# Altium schematic sheet v1.0.SchDoc
size 223 x 104 mm; PageSetup: Record=PageOptions|CenterHorizontal=True|CenterVertical=True|PrintScale=0.85|XCorrection=1.00|YCorrection=1.00|PrintKind=0|BorderSize=5000000|LeftOffset=0|BottomOffset=0|Orientation=2|PaperLength=1000|PaperWidth=1000|Scale=100|PaperSource=15|PrintQuality=-3|MediaType=1|DitherType=10|PrintScaleMode=1|PaperKind=A4|PaperIndex=9
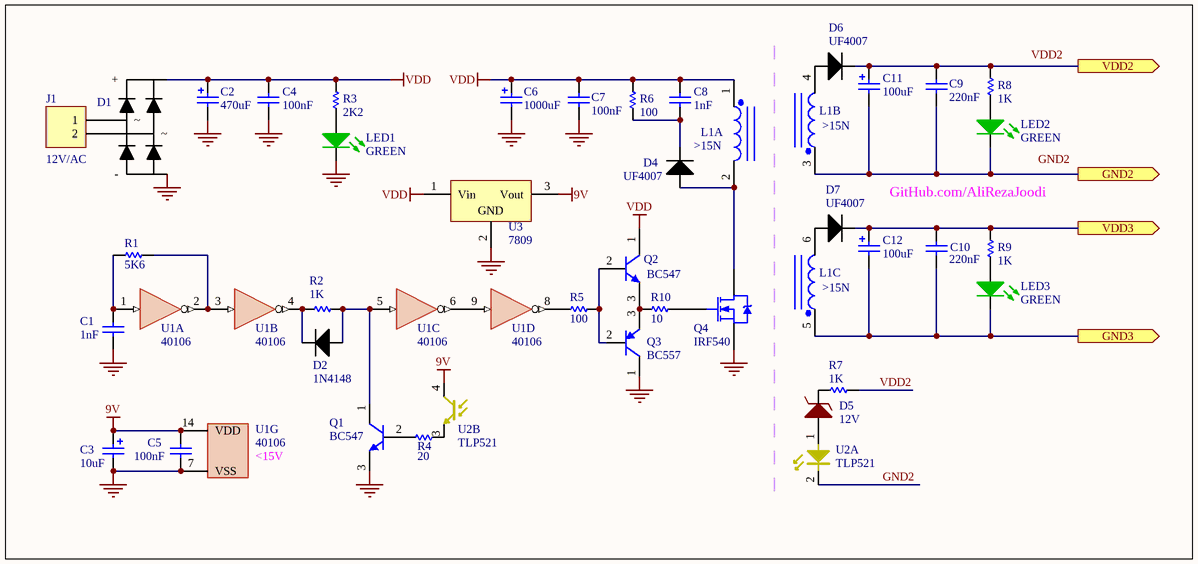
[diagram p0: v1.0.SchDoc]

## Parts
C1  value 1nF  [CAPNTO2.54-3.05x1.78A]  (hidden comment: Cap)
C2  value 470uF  [CAPPR5-10x12.5]  (hidden comment: Cap Pol1)
C3  10uF  [CAPPR5-10x12.5]
C4  value 100nF  [CAPNTO2.54-3.05x1.78A]  (hidden comment: Cap)
C5  100nF  [CAPNTO2.54-3.05x1.78A]
C6  value 1000uF  [CAPPR2.5-6.3x5]  (hidden comment: Cap Pol1)
C7  value 100nF  [CAPNTO2.54-3.05x1.78A]  (hidden comment: Cap)
C8  value 1nF  [CAPNTO2.54-3.56x2.03]  (hidden comment: Cap)
C9  value 220nF  [CAPNTO5.08-7.37x3.94]  (hidden comment: Cap)
C10  value 220nF  [CAPNTO5.08-7.37x3.94]  (hidden comment: Cap)
C11  value 100uF  [CAPPR2.5-6.3x5]  (hidden comment: Cap Pol1)
C12  value 100uF  [CAPPR2.5-6.3x5]  (hidden comment: Cap Pol1)
D1  2A  (value not drawn)
D2  1N4148  [D_THD_AXIAL0.3_DO-35]
D4  UF4007  [D_THD_AXIAL0.3_DO-35]
D5  12V  [D_THD_AXIAL0.3_DO-35]
D6  UF4007  [D_THD_AXIAL0.3_DO-35]
D7  UF4007  [D_THD_AXIAL0.3_DO-35]
J1  Header 2  [Fonics_2PIN_1]  (value not drawn)
L1  >15N  [INDUCTOR3]  (parts A,B,C of 3)
LED1  GREEN  [LED_THD_5MM_GREEN]
LED2  GREEN  [LED_THD_5MM_GREEN]
LED3  GREEN  [LED_THD_5MM_GREEN]
Q1  value BC547  [TO92C]  (hidden comment: NPN)
Q2  Device: BC547  [TO92C]  (hidden comment: NPN)
Q3  BC557  [TO92C]
Q4  IRF540  [TO220V]
R1  5K6  [R_THD_AXIAL0.4(1/4W)]
R2  1K  [R_THD_AXIAL0.4(1/4W)]
R3  2K2  [R_THD_AXIAL0.4(1/4W)]
R4  20  [R_THD_AXIAL0.4(1/4W)]
R5  100  [R_THD_AXIAL0.4(1/4W)]
R6  100  [R_THD_AXIAL0.4(1/4W)]
R7  1K  [R_THD_AXIAL0.4(1/4W)]
R8  1K  [R_THD_AXIAL0.4(1/4W)]
R9  1K  [R_THD_AXIAL0.4(1/4W)]
R10  10  [R_THD_AXIAL0.4(1/4W)]
U1  40106  [DIP_14]  (parts A,B,C,D,G of 7)
U2  TLP521  [DIP_4]  (parts A,B of 2)
U3  7809  [TO220_3PIN_H]

## Ports
GND2 (out), GND3 (out), VDD2 (out), VDD3 (out)

## Nets
9V: C3.1 C5.2 U1.14(VDD) U2.4(C) U3.3(Vout)
GND: C1.1 C2.2 C3.2 C4.1 C5.1 C6.2 C7.1 D1.3(-) LED1.2(K) Q1.3(E) Q3.1(C) Q4.3(S) U1.7(VSS) U3.2(GND)
VDD: C2.1 C4.2 C6.1 C7.2 C8.2 D1.4(+) L1.1 Q2.1(C) R3.2 R6.2 U3.1(Vin)
GND2: C9.1 C11.2 L1.3 LED2.2(K) ; port GND2
GND2: U2.2(K)  [a separate net that carries the same name]
GND3: C10.1 C12.2 L1.5 LED3.2(K) ; port GND3
VDD2: C9.2 C11.1 D6.2(K) R8.2 ; port VDD2
VDD2: R7.1  [a separate net that carries the same name]
VDD3: C10.2 C12.1 D7.2(K) R9.2 ; port VDD3
NetC1_2: C1.2 R1.2 U1.1(I)
NetC8_1: C8.1 D4.2(K) R6.1
NetD1_1: D1.1 J1.2
NetD1_2: D1.2 J1.1
NetD2_1: D2.1(A) Q1.1(C) R2.1 U1.5(I)
NetD2_2: D2.2(K) R2.2 U1.4(~{O})
NetD4_1: D4.1(A) L1.2 Q4.2(D)
NetD5_1: D5.1 U2.1(A)
NetD5_2: D5.2 R7.2
NetD6_1: D6.1(A) L1.4
NetD7_1: D7.1(A) L1.6
NetLED1_1: LED1.1(A) R3.1
NetLED2_1: LED2.1(A) R8.1
NetLED3_1: LED3.1(A) R9.1
NetQ1_2: Q1.2(B) R4.2
NetQ2_2: Q2.2(B) Q3.2(B) R5.1
NetQ2_3: Q2.3(E) Q3.3(E) R10.2
NetQ4_1: Q4.1(G) R10.1
NetR1_1: R1.1 U1.2(~{O}) U1.3(I)
NetR4_1: R4.1 U2.3(E)
NetR5_2: R5.2 U1.8(~{O})
NetU1_6: U1.6(~{O}) U1.9(I)

## Notes on the sheet
- (near J1) 12V/AC
- GitHub.com/AliRezaJoodi
- <15V
- Labels drawn without touching a wire or pin: GND2, VDD2

## Library data of the parts
C1 C4 C5 C7-C10 = Cap: Capacitor; Manufacturer: Generic Components; Class I: Passive; Published: 8-Jun-2000; Revision: July-2002: Re-released for DXP Platform.; Publisher: Altium Limited; Class II: Capacitor
C2 C3 C6 C11 C12 = Cap Pol1: Polarized Capacitor (Radial); Manufacturer: Generic Components; Class I: Passive; Published: 8-Jun-2000; Revision: July-2002: Re-released for DXP Platform.; Publisher: Altium Limited; Class II: Capacitor
D1 = Diode_Bridge_2Form: Full Wave Diode Bridge; Manufacturer: Generic Components; Class I: Discrete; Class II: Rectifier - Bridge; Published: 8-Jun-2000; Revision: July-2002: Re-released for DXP Platform.; Publisher: Altium Limited
D2 D4 D6 D7 = Diode: Diode,; Revision: July-2002: Re-released for DXP Platform.
D5 = Diode_Zener: Diode, Zener; Revision: July-2002: Re-released for DXP Platform.
J1 = Header 2: Header, 2-Pin; LatestRevisionDate: 17-Jul-2002; LatestRevisionNote: Re-released for DXP Platform.; Publisher: Altium Limited
L1 = Inductor 3: Publisher: Altium Limited
LED1-LED3 = LED_GREEN: LED, Green; Manufacturer: Generic Components; Class I: Optoelectronic; Published: 8-Jun-2000; Revision: July-2002: Re-released for DXP Platform.; Publisher: Altium Limited; Class II: LED
Q1 = NPN: NPN Bipolar Transistor; Manufacturer: Generic Components; Class I: Discrete; Class II: BJT - Low Power; Published: 8-Jun-2000; Revision: July-2002: Re-released for DXP Platform.; Publisher: Altium Limited
Q2 = NPN: Silicon Bipolar Transistor; Package Reference: TO-92A
Q3 = PNP: PNP Bipolar Transistor; Manufacturer: Generic Components; Class I: Discrete; Class II: BJT - Low Power; Published: 8-Jun-2000; Revision: July-2002: Re-released for DXP Platform.; Publisher: Altium Limited
Q4 = IRFP141: 31A, 80V, 0.077 Ohm, N-Channel Power MOSFET; Note: Pin 2 (drain) is electrically connected to the case metal; Published: 8-Jun-2000; LatestRevisionDate: 17-Jul-2002; LatestRevisionNote: Re-released for DXP Platform.; DatasheetVersion: Jan-1998; PackageVersion: 1994; PackageReference: TO-247; Publisher: Altium Limited; PackageDescription: SIP with Mounting Hole; 3 Leads; Body 20.6 x 15.6 x 4.7 mm (typ); Pitch 5.56 mm; ComponentLink1Description: Manufacturer Link; ComponentLink1URL: http://www.intersil.com/cda/home/
R1-R10 = Resistor: Revision: July-2002: Re-released for DXP Platform.
U1 = 40106: Hex inverting Schmitt trigger, 14-Pin; Publisher: Altium Limited; ComponentLink1URL: http://www.nxp.com
U2 = Optoisolator: Publisher: Altium Limited
U3 = Volt Reg: Voltage Regulator, Linear, Fixed, 5v, 1.5A; Revision: July-2002: Re-released for DXP Platform.